# EAGLE design SparkX_smol_Environmental (EAGLE 9.6.2)
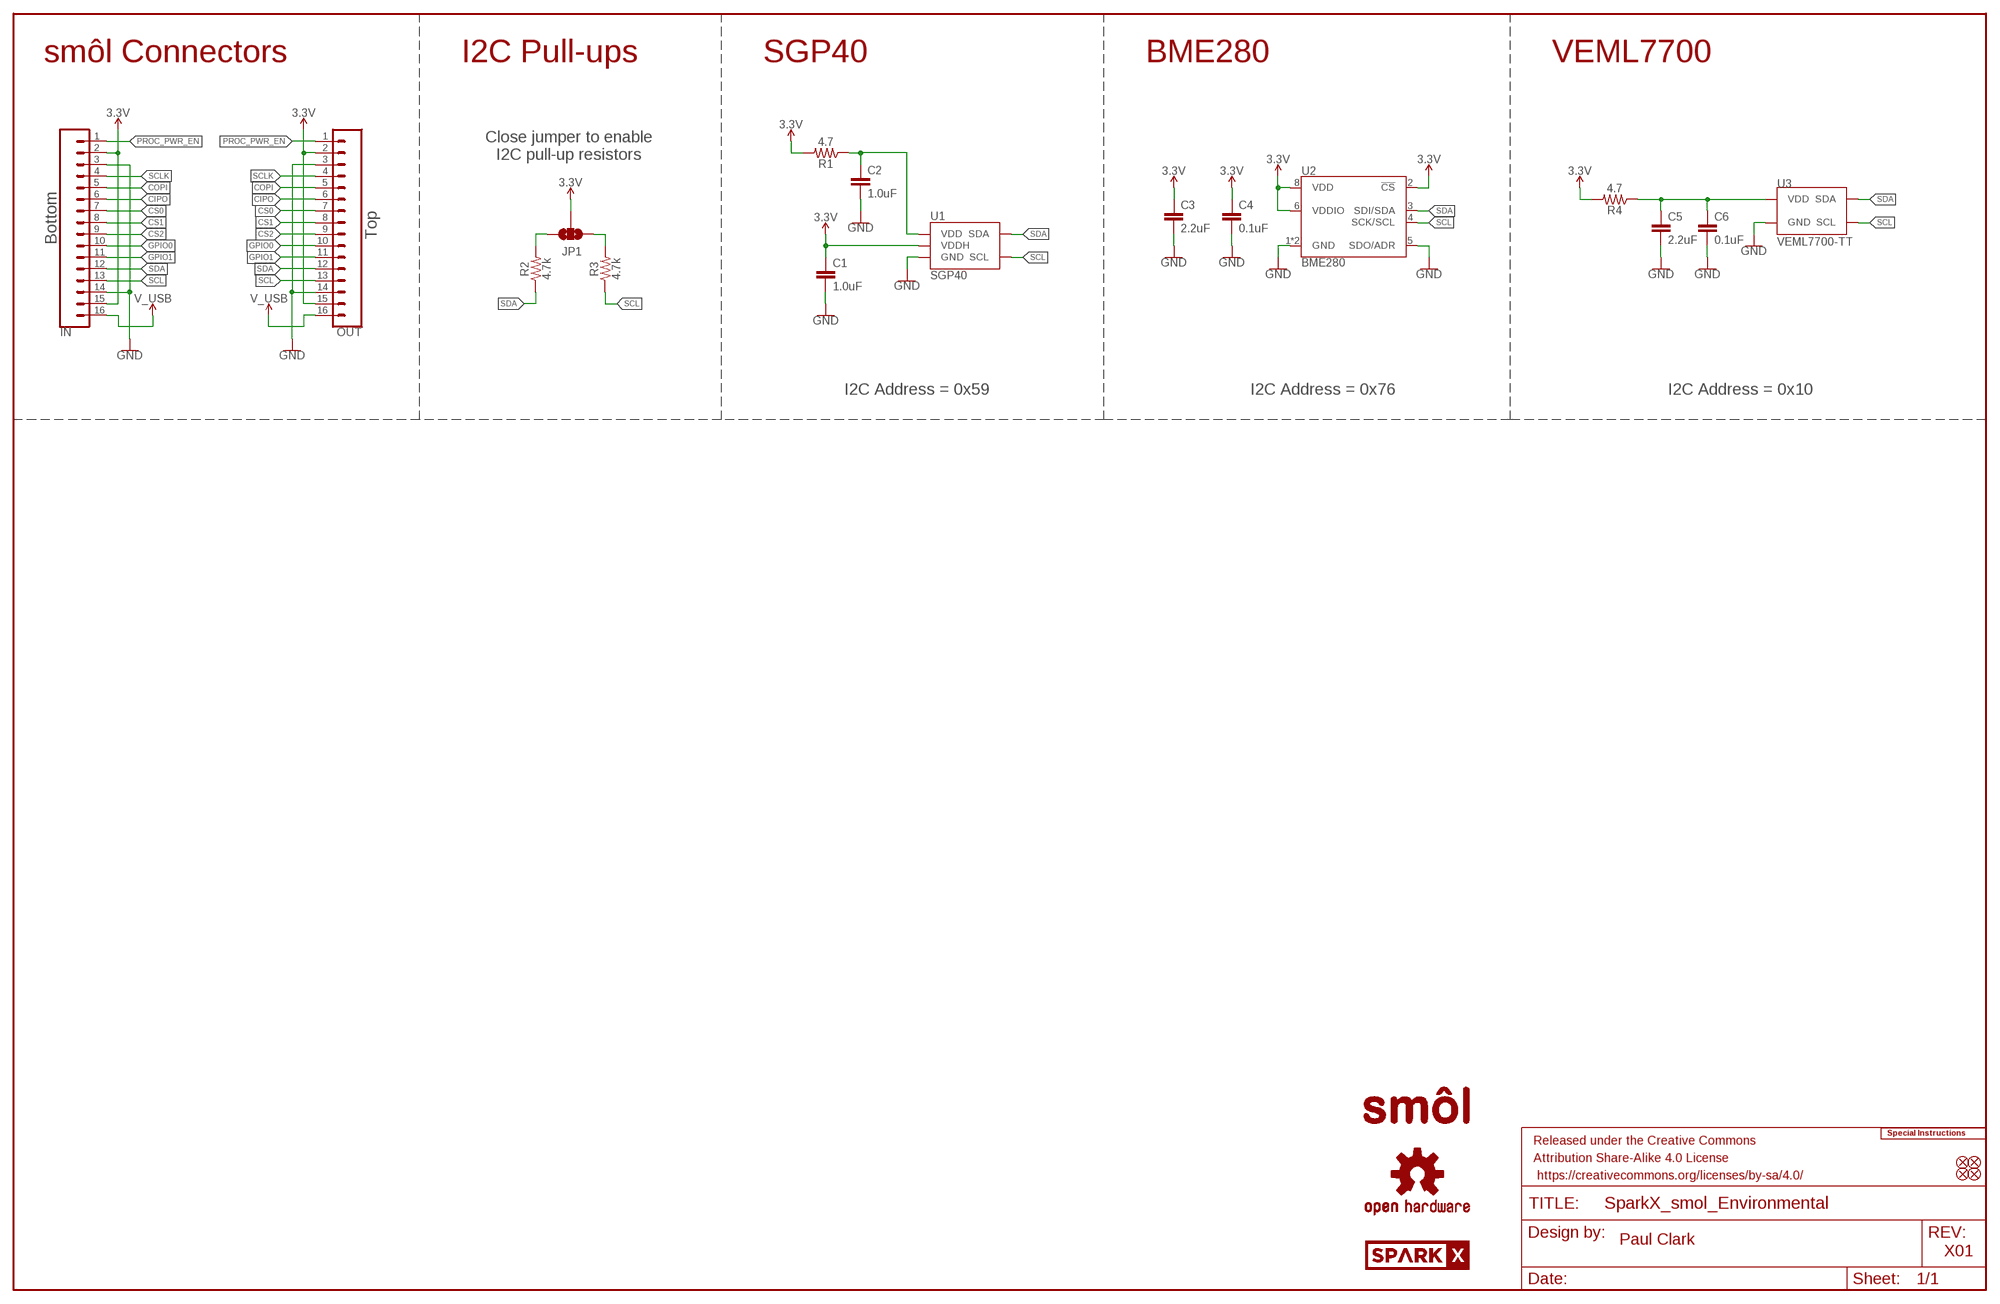
[diagram p0: schematic, sheet 1]

## Parts
C1  1.0uF  1.0UF-0402T-16V-10%  [0402-TIGHT]
C2  1.0uF  1.0UF-0402T-16V-10%  [0402-TIGHT]
C3  2.2uF  2.2UF-0402_TIGHT-10V-10%-X5R  [0402-TIGHT]
C4  0.1uF  0.1UF-0402T-6.3V-10%-X7R  [0402-TIGHT]
C5  2.2uF  2.2UF-0402_TIGHT-10V-10%-X5R  [0402-TIGHT]
C6  0.1uF  0.1UF-0402T-6.3V-10%-X7R  [0402-TIGHT]
FD1  FIDUCIALUFIDUCIAL  [FIDUCIAL-MICRO]
FD2  FIDUCIALUFIDUCIAL  [FIDUCIAL-MICRO]
FD3  FIDUCIALUFIDUCIAL  [FIDUCIAL-MICRO]
FD4  FIDUCIALUFIDUCIAL  [FIDUCIAL-MICRO]
FRAME1  FRAME-LEDGER  [CREATIVE_COMMONS]
IN  CONN_16FPC_16_0.5MM  [FPC_16_0.5MM]
JP1  JUMPER-SMT_3_NO_SILK  [SMT-JUMPER_3_NO_SILK]
LOGO1  SPECIAL_INSTRUCTIONS-ORDERING  [ORDERING_INSTRUCTIONS]
LOGO2  OSHW-LOGOMINI  [OSHW-LOGO-MINI]
LOGO3  OSHW-LOGOMINI  [OSHW-LOGO-MINI]
OUT  CONN_16FPC_16_0.5MM  [FPC_16_0.5MM]
R1  4.7  4.7OHM-0402T-1/16W-1%  [0402-TIGHT]
R2  4.7k  4.7KOHM-0402T-1/16W-1%  [0402-TIGHT]
R3  4.7k  4.7KOHM-0402T-1/16W-1%  [0402-TIGHT]
R4  4.7  4.7OHM-0402T-1/16W-1%  [0402-TIGHT]
U1  SGP40  [SGP40]
U2  BME280  [LGA-8-2.5X2.5]
U3  VEML7700-TT  [VEML7700_TT]
U$1  SPARKX-LOGO3  [SPARKX-SMALL]
U$3  SMOL_LOGOSMALL  [SMOL_SMALL]
U$9  SMOL_LOGOSMALL  [SMOL_SMALL]

## Nets
3.3V: C1.1 C3.1 C4.1 IN.2 IN.15 JP1.2 OUT.2 OUT.15 R1.2 R4.2 U1.5(VDDH) U2.2(!CS) U2.6(VDDIO) U2.8(VDD)
CIPO: IN.6 OUT.6
COPI: IN.5 OUT.5
CS0: IN.7 OUT.7
CS1: IN.8 OUT.8
CS2: IN.9 OUT.9
GND: C1.2 C2.2 C3.2 C4.2 C5.2 C6.2 IN.3 IN.14 OUT.3 OUT.14 U1.2(GND) U1.4(GND) U1.DIEPAD(GND) U2.1(GND) U2.5(SDO/ADR) U2.7(GND) U3.3(GND)
GPIO0: IN.10 OUT.10
GPIO1: IN.11 OUT.11
N$1: C2.1 R1.1 U1.1(VDD)
N$2: JP1.3 R2.2
N$3: JP1.1 R3.2
N$4: C5.1 C6.1 R4.1 U3.2(VDD)
PROC_PWR_EN: IN.1 OUT.1
SCL: IN.13 OUT.13 R3.1 U1.6(SCL) U2.4(SCK/SCL) U3.1(SCL)
SCLK: IN.4 OUT.4
SDA: IN.12 OUT.12 R2.1 U1.3(SDA) U2.3(SDI/SDA) U3.4(SDA)
V_USB: IN.16 OUT.16

## Notes on the sheet
- smôl Connectors | I2C Pull-ups | SGP40 | BME280 | VEML7700
- Close jumper to enable
  I2C pull-up resistors
- Top
- Bottom
- I2C Address = 0x59 | I2C Address = 0x76 | I2C Address = 0x10
- Paul Clark
- X01

## Library data of the parts
C1 C2 = SparkFun-Capacitors:1.0UF: 1µF ceramic capacitors A capacitor is a passive two-terminal electrical component used to store electrical energy temporarily in an electric field.; PROD_ID: CAP-12417
C3 C5 = SparkFun-Capacitors:2.2UF: 2.2µF ceramic capacitors A capacitor is a passive two-terminal electrical component used to store electrical energy temporarily in an electric field.; PROD_ID: CAP-14232
C4 C6 = SparkFun-Capacitors:0.1UF: 0.1µF ceramic capacitors A capacitor is a passive two-terminal electrical component used to store electrical energy temporarily in an electric field.; PROD_ID: CAP-14993
FD1-FD4 = SparkFun-Aesthetics:FIDUCIAL: Fiducial Alignment Points Point-of-reference for pick-and-place machines and other optical instruments.
FRAME1 = SparkFun-Aesthetics:FRAME-LEDGER: Schematic Frame - Ledger Standard 11x14 US Ledger frame
IN OUT = SparkFun-Connectors:CONN_16: Multi connection point. Often used as Generic Header-pin footprint for 0.1 inch spaced/style header connections On any of the 0.1 inch spaced packages, you can populate with these: Break Away Headers - Straight <https://www.sparkfun.com/products/116> (PRT-00116) Break Away Male Headers - Right Angle <https://www.sparkfun.com/products/553> (PRT-00553) Female Headers <https://www.sparkfun.com/products/115> (PRT-00115) Break Away Headers - Machine Pin <https://www.sparkfun.com/products/117> (PRT-00117) Break Away Female Headers - Swiss Machine Pin <https://www.sparkfun.com/products/743> (PRT-00743) For SCREWTERMINALS and SPRING TERMINALS visit here: Screw Terimnals on SparkFun.com <https://www.sparkfun.com/search/results?term=Screw+Terminals> (5mm/3.5mm/2.54mm spacing) This device is also useful as a general connection point to wire up your design to another part of your project. Our various solder wires solder well into these plated through hole pads. Hook-Up Wire - Assortment (Stranded, 22 AWG) <https://www.sparkfun.com/products/11375> (PRT-11375) Hook-Up Wire - Assortment (Solid Core, 22 AWG) <https://www.sparkfun.com/products/11367> (PRT-11367) View the entire wire category on our website here <https://www.sparkfun.com/categories/141> Special notes: Molex polarized connector foot print use with SKU : PRT-08231 with associated crimp pins and housings. 1MM SMD Version SKU: PRT-10208 NOTES ON THE VARIANTS LOCK and LOCK_LONGPADS... This footprint was designed to help hold the alignment of a through-hole component (i.e. 6-pin header) while soldering it into place. You may notice that each hole has been shifted either up or down by 0.005 of an inch from it's more standard position (which is a perfectly straight line). This slight alteration caused the pins (the squares in the middle) to touch the edges of the holes. Because they are alternating, it causes a "brace" to hold the component in place. 0.005 has proven to be the perfect amount of "off-center" position when using our standard breakaway headers. Although looks a little odd when you look at the bare footprint, once you have a header in there, the alteration is very hard to notice. Also,if you push a header all the way into place, it is covered up entirely on the bottom side.; PROD_ID: CONN-16066
JP1 = SparkFun-Jumpers:JUMPER-SMT_3_NO: Normally open jumper This jumper has three pads in close proximity to each other. Apply solder to close the connection(s).
LOGO1 = SparkFun-Aesthetics:SPECIAL_INSTRUCTIONS: Special Ordering/Production Instructions Alert Symbol for special PCB ordering instructions or unique production process warnings. Ordering Instructions Production Instructions Types of information that should be added to box: Copper weight Soldermask color Silk color PCB thickness Number of layers PCB Standard: 1.6mm FR4 1 oz copper immersion silver plating red soldermask white silkscreen Types of information that should be added to box: Special wash requirements Depaneling instructions Humidification Glue curing Default text settings: 0.07 inch 9% ratio 50% line distance
LOGO2 LOGO3 = SparkFun-Aesthetics:OSHW-LOGO: Open-Source Hardware (OSHW) Logo This logo indicates the piece of hardware it is found on incorporates a OSHW license and/or adheres to the definition of open source hardware found here: http://freedomdefined.org/OSHW
R1 R4 = SparkFun-Resistors:4.7OHM: 4.7Ω resistor A resistor is a passive two-terminal electrical component that implements electrical resistance as a circuit element. Resistors act to reduce current flow, and, at the same time, act to lower voltage levels within circuits. - Wikipedia; PROD_ID: RES-16312
R2 R3 = SparkFun-Resistors:4.7KOHM: 4.7kΩ resistor A resistor is a passive two-terminal electrical component that implements electrical resistance as a circuit element. Resistors act to reduce current flow, and, at the same time, act to lower voltage levels within circuits. - Wikipedia; PROD_ID: RES-15343
U1 = SparkFun-Sensors:SGP40: The SGP40 is a digital gas sensor designed for easy integration into air purifiers or demand-controlled ventilation systems.; DIGIKEY_PART: 1649-SGP40-D-R4CT-ND; PROD_ID: IC-15580
U2 = SparkFun-Sensors:BME280: Bosch BME280 – Combined Humidity and Pressure Sensor The BME280 is as combined digital humidity, pressure and temperature sensor based on proven sensing principles. The sensor module is housed in an extremely compact metal-lid LGA package with a footprint of only 2.5×2.5mm² with a height of 0.93mm. Its small dimensions and its low power consumption allow the implementation in battery driven devices such as handsets, GPS modules or watches. Datasheet <https://cdn.sparkfun.com/assets/learn_tutorials/4/1/9/BST-BME280_DS001-10.pdf> SparkFun Products SparkFun Atmospheric Sensor Breakout - BME280 <https://www.sparkfun.com/products/13676> (SEN-13676); PROD_ID: IC-13090
U3 = SparkFun-Sensors:VEML7700: Vishay VEML7700 Ambient Light Sensor VEML7700-TR is the side-view part VEML7700-TT is the top-view part; PROD_ID: IC-16311
U$1 = SparkX:SPARKX-LOGO
U$3 U$9 = SparkX:SMOL_LOGO

## Net classes
1 Power: width 0.305 mm
2 3.3V: width 0.508 mm

## Board
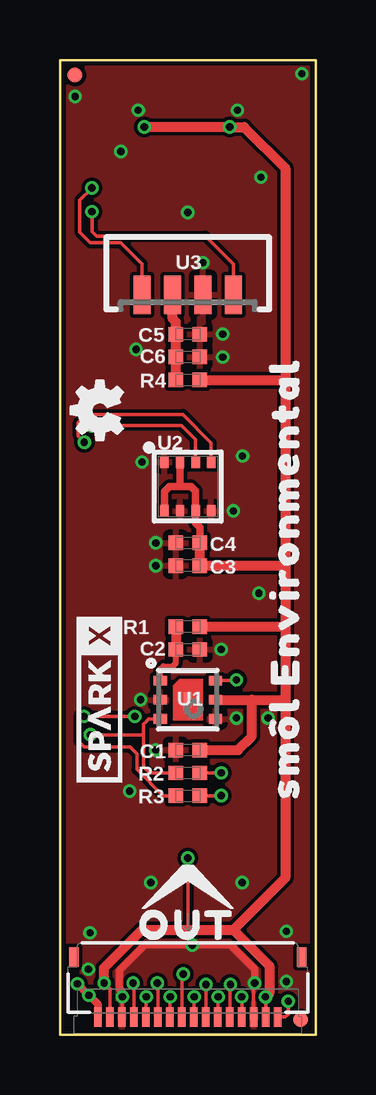
[diagram p1: board, top side]
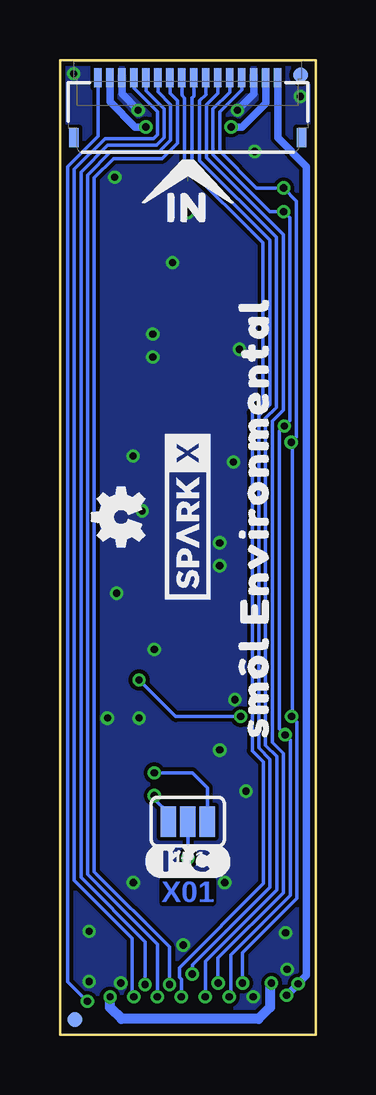
[diagram p2: board, bottom side, seen from below]

Size 10.67 x 40.64 mm. Coordinates in mm from the lower left corner, seen from the top.
Outline: 0,40.64 0,0 10.67,0 10.67,40.64 0,40.64
Copper layers (1*16): Top 0.035mm / dielectric 1.5mm / Bottom 0.035mm
Design rules "SparkFun-2-Layer-Minimum-JLCPCB": minimum track width 5mil, minimum drill 0.3mm, track to track 5mil, track to pad 5mil, pad to pad 5mil, via to via 5mil, smd to smd 5mil, copper to edge 7mil, drill to drill 7mil, minimum pad ring 5mil, minimum via ring 5mil, stop-mask expansion 2.5mil, vias tented up to drill 25mil, thermal gap 10mil

### Footprints (pad centres in the part's own frame; a part is rotated, then mirrored left to right if it is on the bottom)
0402-TIGHT = smd 0.6 x 0.6: 1 -0.5,0; 2 0.5,0
FIDUCIAL-MICRO = smd 0.635 x 0.635: 1 0,0
FPC_16_0.5MM = smd 0.3 x 0.8: 1 -3.75,1.35; 2 -3.25,1.35; 3 -2.75,1.35; 4 -2.25,1.35; 5 -1.75,1.35; 6 -1.25,1.35; 7 -0.75,1.35; 8 -0.25,1.35; 9 0.25,1.35; 10 0.75,1.35; 11 1.25,1.35; 12 1.75,1.35; 13 2.25,1.35; 14 2.75,1.35; 15 3.25,1.35; 16 3.75,1.35 | smd 0.4 x 0.8: MP1 -4.75,-1.15; MP2 4.75,-1.15
SMT-JUMPER_3_NO_SILK = smd 0.635 x 1.27: 1 -0.813,0; 2 0,0; 3 0.813,0
SGP40 = smd 0.55 x 0.4: 1 -1.15,0.8; 2 -1.15,0; 3 -1.15,-0.8; 4 1.15,-0.8; 5 1.15,0; 6 1.15,0.8 | smd 0.305 x 0.61: DIEPAD 0,0
LGA-8-2.5X2.5 = smd 0.35 x 0.5: 1 -0.975,1.025; 2 -0.325,1.025; 3 0.325,1.025; 4 0.975,1.025; 5 0.975,-1.025; 6 0.325,-1.025; 7 -0.325,-1.025; 8 -0.975,-1.025
VEML7700_TT = smd 0.7 x 1.6: 1 -1.905,-0.9; 2 -0.635,-0.9; 3 0.635,-0.9; 4 1.905,-0.9

### Placement (x,y rotation side)
C1  5.33,11.87 180 top
C2  5.33,16.07 0 top
C3  5.33,19.56 180 top
C4  5.33,20.51 180 top
C5  5.33,29.21 0 top
C6  5.33,28.26 0 top
FD1  0.64,40.01 0 top
FD2  0.64,40.01 0 bottom
FD3  10.03,0.64 0 top
FD4  10.03,0.64 0 bottom
FRAME1  45.72,-10.16 0 top  (outside the outline)
IN  5.33,38.54 0 bottom
JP1  5.33,8.89 0 bottom
LOGO1  19.05,50.8 0 top  (outside the outline)
LOGO2  1.65,26.04 90 top
LOGO3  8.13,21.59 90 bottom
OUT  5.33,2.1 180 top
R1  5.33,17.02 0 top
R2  5.33,10.92 0 top
R3  5.33,9.97 0 top
R4  5.33,27.3 0 top
U1  5.33,13.97 0 top
U2  5.33,22.86 0 top
U3  5.33,31.75 0 top
U$1  1.65,13.97 90 top
U$2  [SM�L_ENVIRONMENTAL0]  9.4,19.05 90 top
U$3  5.33,6.41 0 top
U$4  [SM�L_ENVIRONMENTAL0]  2.54,21.59 90 bottom
U$5  [#I�C#0]  5.33,7.24 0 bottom
U$8  [IN0]  5.33,34.48 0 bottom
U$9  5.33,35.81 0 bottom
U$17  [OUT0]  5.33,4.57 0 top
U$20  SPARKX-LOGO3  [SPARKX-SMALL]  5.33,21.59 90 bottom

### Tracks (layer width: path | path; a pad name or v marks a point on that pad's centre or on a via)
3.3V  (via drill 0.3)
  Top 0.152: OUT.2 v8.58,1.58 | OUT.15 2.08,1.92 v1.84,2.16 | v5.33,7.37 5.33,4.38
  Top 0.305: C4.1 5.83,21.15 5.66,21.33 U2.6 5.66,22.66 5.46,22.86 5.02,22.86 | U2.8 4.36,22.65 4.57,22.86 5.02,22.86 | U2.2 5.01,22.87 5.02,22.86
  Top 0.406: v1.84,2.16 1.84,2.79 3.43,4.38 5.33,4.38 7.24,4.38 | 7.24,4.38 8.73,2.88 8.73,1.73 v8.58,1.58 | v3.52,37.85 v7.08,37.85 7.69,37.85 9.4,36.13 9.4,27.3 | 7.24,4.38 9.4,6.54 9.4,13.97 | 9.4,27.3 9.4,19.56 | 9.4,19.56 9.4,17.02 | 9.4,17.02 9.4,13.97 | R4.2 9.4,27.3 | 9.4,19.56 C3.1 C4.1 | U1.5 8,13.97 | 8,13.97 9.4,13.97 | C1.1 7.43,11.87 8,12.45 8,13.97 | R1.2 9.4,17.02
  Bottom 0.152: JP1.2 v5.33,7.37
  Bottom 0.305: IN.15 2.08,38.84 3.08,37.85 v3.52,37.85 | v7.08,37.85 7.53,37.85 8.58,38.9 IN.2
  Bottom 0.406: v1.84,2.16 1.91,2.1 1.91,1.14 2.38,0.66 8.1,0.66 8.58,1.14 v8.58,1.58
CIPO  (via drill 0.3)
  Top 0.152: OUT.6 6.58,1.57 v6.6,1.59
  Bottom 0.152: IN.6 6.58,39.32 6.05,38.78 6.05,37.29 6.53,36.81 8.55,36.81 9.51,35.85 9.51,6.68 6.6,3.77 v6.6,1.59
COPI  (via drill 0.3)
  Top 0.152: OUT.5 7.08,2.07 v7.11,2.1
  Bottom 0.152: IN.5 7.08,39.36 6.33,38.6 6.33,37.4 6.64,37.09 8.67,37.09 9.79,35.96 9.79,6.57 7.11,3.89 v7.11,2.1
CS0  (via drill 0.3)
  Top 0.152: OUT.7 6.08,2.08 v6.1,2.1
  Bottom 0.152: IN.7 6.08,39.26 5.77,38.94 5.77,37.17 6.41,36.53 8.44,36.53 9.23,35.73 9.23,6.8 6.1,3.66 v6.1,2.1
CS1  (via drill 0.3)
  Top 0.152: OUT.8 5.58,1.57 v5.6,1.59
  Bottom 0.152: IN.8 5.58,39.16 5.46,39.04 5.46,36.28 2.19,33.02 2.19,26.39 2.65,25.94 2.65,11.84 2.18,11.38 2.18,6.31 5.69,2.8 5.69,2.4 5.6,2.32 v5.6,1.59
CS2  (via drill 0.3)
  Top 0.152: OUT.9 5.08,2.48 v5.14,2.54
  Bottom 0.152: v5.14,2.54 5.14,2.91 1.9,6.16 1.9,11.49 2.37,11.96 2.37,25.82 1.91,26.27 1.91,33.13 5.15,36.37 5.15,39.07 5.08,39.13 IN.9
GND  (via drill 0.3)
  Top 0.152: v8.13,2.16 8.06,2.1 8.06,0.77 OUT.3 | OUT.14 2.58,1.57 v2.6,1.59
  Top 0.305: v2.6,1.59 2.6,1.82 2.49,1.93 2.49,2.68 3.56,3.75 v5.52,3.75 7.11,3.75 8.13,2.73 v8.13,2.16
  Bottom 0.305: IN.14 2.58,39.23 v3.27,38.54 | IN.3 8.08,39.23 v7.4,38.54
  other vias: 2.54,36.83 1.25,4.25 1.19,2.73 3.79,6.35 7.6,6.35 8.38,35.75 10.1,40.07 0.64,39.12 9.45,2.22 5.33,34.29 5.97,32.19 6.79,29.21 6.79,28.26 3.43,23.88 4,20.51 4,19.56 3.37,13.97 4,11.87 9.45,4.32 7.24,21.84 7.37,13.21 6.73,16.07 3.17,28.57 7.62,24.13 2.91,10.16 8.68,13.21 8.3,18.41
  pour Top (isolate 0.152, rank 3): 0,40.64 10.67,40.64 10.67,0 0,0
  pour Bottom (isolate 0.152, rank 2): 0,40.64 10.67,40.64 10.67,0 0,0
GPIO0  (via drill 0.3)
  Top 0.152: OUT.10 4.58,1.57 v4.6,1.59
  Bottom 0.152: IN.10 4.58,39.2 4.84,38.94 4.84,36.45 1.63,33.25 1.63,26.16 2.09,25.71 2.09,12.07 1.62,11.61 1.62,6.04 4.6,3.06 v4.6,1.59
GPIO1  (via drill 0.3)
  Top 0.152: OUT.11 4.08,2.14 v4.06,2.16
  Bottom 0.152: IN.11 4.08,39.26 4.56,38.78 4.56,36.57 1.35,33.36 1.35,26.04 1.81,25.59 1.81,12.19 1.34,11.72 1.34,5.93 4.06,3.2 v4.06,2.16
N$1
  Top 0.254: U1.1 4.18,15.23 4.32,15.37 4.7,15.37 4.83,15.5 C2.1
  Top 0.406: R1.1 C2.1
N$2  (via drill 0.3)
  Top 0.152: v6.73,10.92 R2.2
  Bottom 0.152: JP1.3 4.52,10.3 5.14,10.92 v6.73,10.92
N$3  (via drill 0.3)
  Top 0.152: v6.73,9.97 R3.2
  Bottom 0.152: JP1.1 6.15,9.26 6.73,9.84 v6.73,9.97
N$4
  Top 0.406: R4.1 C6.1 C5.1 4.83,29.72 4.7,29.85 U3.2
PROC_PWR_EN  (via drill 0.3)
  Top 0.152: v9.53,1.4 9.53,0.87 9.4,0.75 OUT.1
  Bottom 0.152: IN.1 9.08,37.46 10.35,36.2 10.35,2.22 v9.53,1.4
SCL  (via drill 0.3)
  Top 0.152: OUT.13 3.08,2.12 v3.05,2.16 | v1.33,35.31 0.83,34.8 0.83,33.47 1.27,33.02 2.54,33.02 3.43,32.13 U3.1 | v1.02,24.7 0.76,24.96 0.76,25.53 1.1,25.86 5.12,25.86 6.31,24.68 U2.4 | v3.13,13.27 v1,13.27 0.79,13.06 0.79,12.23 1.02,12 2.92,12 3.21,11.71 3.21,11.06 4.3,9.97 R3.1 | v7.37,14.8 7.34,14.77 U1.6
  Bottom 0.152: IN.13 3.08,39.41 4,38.49 4,36.83 2.48,35.31 v1.33,35.31 v1.33,35.3 0.8,34.77 0.8,24.92 v1.02,24.7 0.97,24.66 0.97,13.3 v1,13.27 0.78,13.05 0.78,5.69 3.05,3.43 v3.05,2.16 | v3.13,13.27 5.84,13.27 v7.37,14.8
SCLK  (via drill 0.3)
  Top 0.152: OUT.4 v7.58,1.59 | v7.58,1.59
  Bottom 0.152: IN.4 7.58,39.47 6.61,38.49 6.61,37.52 6.76,37.37 8.79,37.37 10.07,36.08 10.07,6.45 7.65,4.03 7.65,1.65 v7.58,1.59
SDA  (via drill 0.3)
  Top 0.152: OUT.12 3.58,1.57 v3.6,1.59 | v1.33,34.32 1.33,33.49 1.52,33.3 6.07,33.3 7.24,32.13 U3.4 | U2.3 5.66,24.82 5.08,25.4 1.32,25.4 v1.3,25.38 | U1.3 3.69,13.17 3.61,13.08 3.61,13.07 3.49,12.96 3.49,12.51 | R2.1 3.75,10.92 3.49,11.18 3.49,12.51 | v1.27,12.51 3.49,12.51
  Bottom 0.152: IN.12 3.58,39.3 4.28,38.6 4.28,36.68 1.91,34.32 v1.33,34.32 1.07,34.06 1.07,25.61 v1.3,25.38 1.51,25.18 1.51,12.75 v1.27,12.51 1.06,12.3 1.06,5.81 3.54,3.33 3.54,1.65 v3.6,1.59
V_USB  (via drill 0.3)
  Top 0.305: OUT.16 1.58,1.27 v1.21,1.65 v0.73,2.13
  Bottom 0.305: IN.16 1.58,37.4 0.38,36.2 0.38,2.48 v0.73,2.13 v1.21,1.65

### Text on the board
Bottom: X01
Measures: Dimensions in Inches
tDocu: 2-Layer Board / 0.8mm Thickness / 1oz Copper (Outer layers) / HASL Finish | Paul Clark